# EAGLE design 40G_ACCELEROMETER_REV_2 (EAGLE 9.6.2)
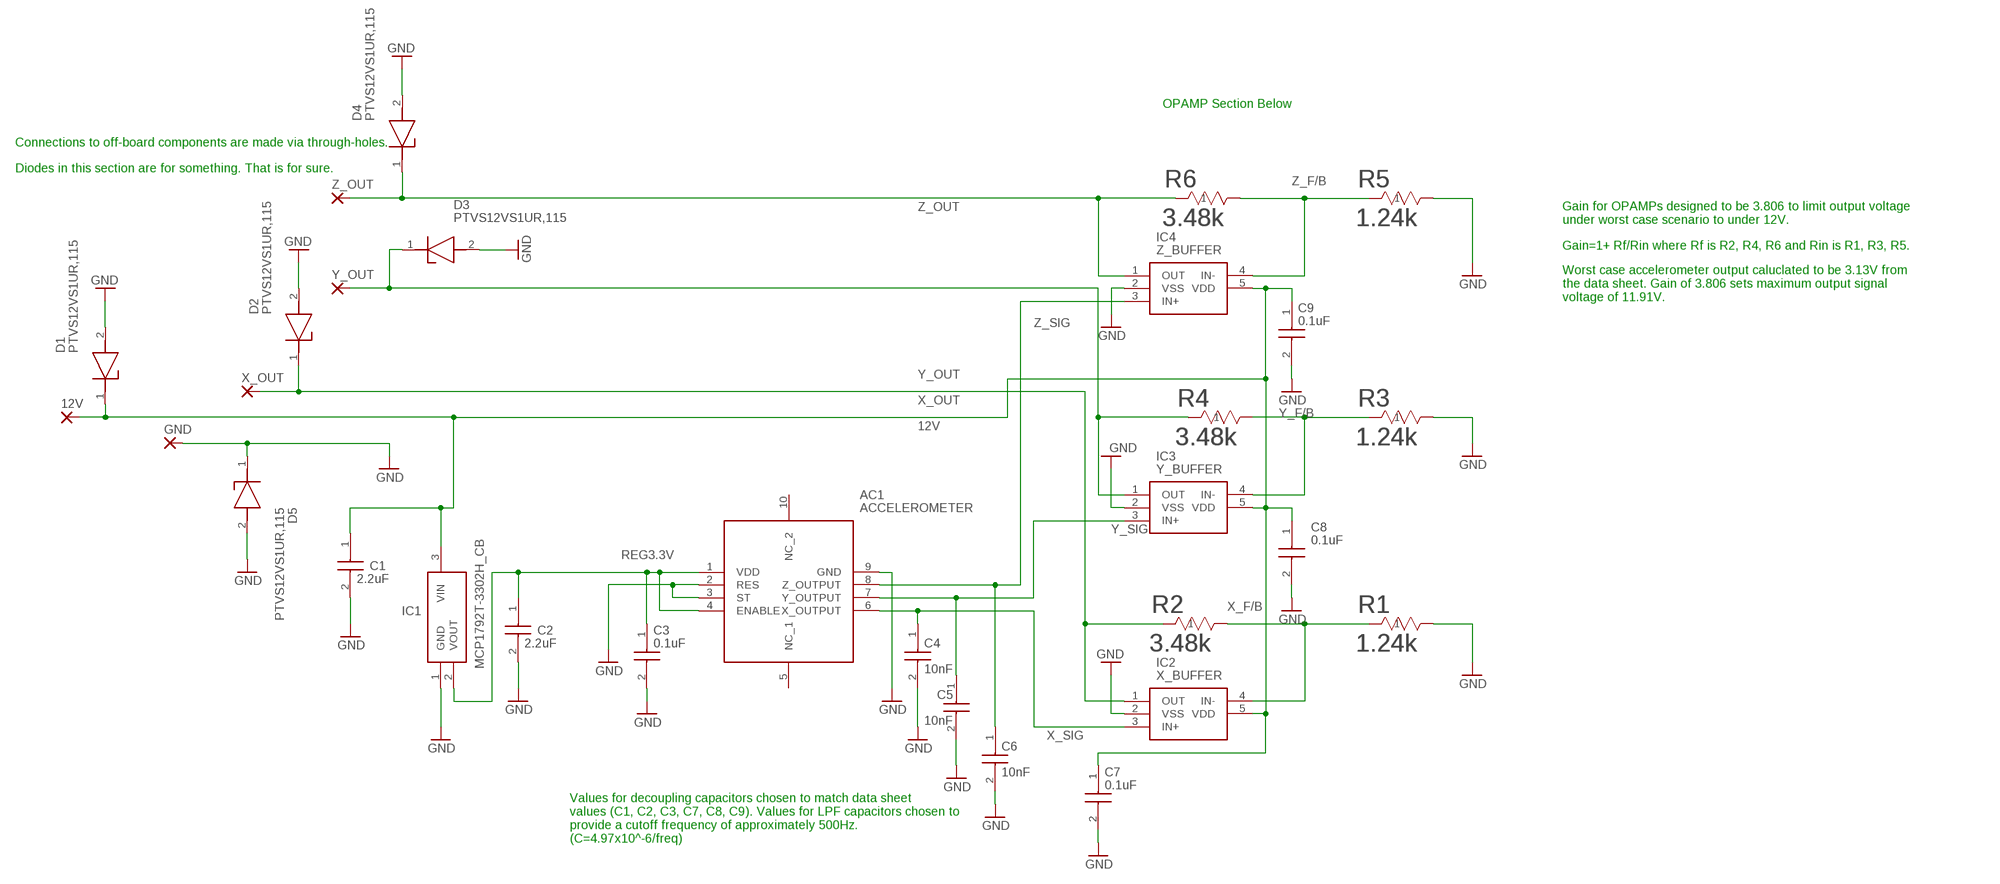
[diagram p0: schematic, sheet 1]

## Parts
12V  2,54/1,1  [2,54/1,1]
AC1  ACCELEROMETER  KX220-1072  [KX2201072]
C1  2.2uF  CGA3E1X7R0J225K080AC  [CAPC1608X90N]
C2  2.2uF  CGA3E1X7R0J225K080AC  [CAPC1608X90N]
C3  0.1uF  CGA3E2X7R1H104K080AE  [CAPC1608X90N]
C4  10nF  CGA3E1C0G2A103J080AE  [CAPC1608X90N]
C5  10nF  CGA3E1C0G2A103J080AE  [CAPC1608X90N]
C6  10nF  CGA3E1C0G2A103J080AE  [CAPC1608X90N]
C7  0.1uF  CGA3E2X7R1H104K080AE  [CAPC1608X90N]
C8  0.1uF  CGA3E2X7R1H104K080AE  [CAPC1608X90N]
C9  0.1uF  CGA3E2X7R1H104K080AE  [CAPC1608X90N]
D1  PTVS12VS1UR,115  [SOD123W]
D2  PTVS12VS1UR,115  [SOD123W]
D3  PTVS12VS1UR,115  [SOD123W]
D4  PTVS12VS1UR,115  [SOD123W]
D5  PTVS12VS1UR,115  [SOD123W]
GND  2,54/1,1  [2,54/1,1]
IC1  MCP1792T-3302H_CB  [SOT95P255X145-3N]
IC2  X_BUFFER  NCS21911SN2T1G  [SOT95P275X110-5N]
IC3  Y_BUFFER  NCS21911SN2T1G  [SOT95P275X110-5N]
IC4  Z_BUFFER  NCS21911SN2T1G  [SOT95P275X110-5N]
R1  1.24k  TNPW04021K24BEED  [RES_TNPW0402_VIS]
R2  3.48k  TNPW04023K48BEED  [RES_TNPW0402_VIS]
R3  1.24k  TNPW04021K24BEED  [RES_TNPW0402_VIS]
R4  3.48k  TNPW04023K48BEED  [RES_TNPW0402_VIS]
R5  1.24k  TNPW04021K24BEED  [RES_TNPW0402_VIS]
R6  3.48k  TNPW04023K48BEED  [RES_TNPW0402_VIS]
X_OUT  2,54/1,1  [2,54/1,1]
Y_OUT  2,54/1,1  [2,54/1,1]
Z_OUT  2,54/1,1  [2,54/1,1]

## Nets
12V: 12V.1(P) C1.1 C7.1 C8.1 C9.1 D1.1(K) IC1.3(VIN) IC2.5(VDD) IC3.5(VDD) IC4.5(VDD)
GND: AC1.2(RES) AC1.3(ST) AC1.9(GND) C1.2 C2.2 C3.2 C4.2 C5.2 C6.2 C7.2 C8.2 C9.2 D1.2(A) D2.2(A) D3.2(A) D4.2(A) D5.1(K) D5.2(A) GND.1(P) IC1.1(GND) IC2.2(VSS) IC3.2(VSS) IC4.2(VSS) R1.2 R3.2 R5.2
REG3.3V: AC1.1(VDD) AC1.4(ENABLE) C2.1 C3.1 IC1.2(VOUT)
X_F/B: IC2.4(IN-) R1.1 R2.2
X_OUT: D2.1(K) IC2.1(OUT) R2.1 X_OUT.1(P)
X_SIG: AC1.6(X_OUTPUT) C4.1 IC2.3(IN+)
Y_F/B: IC3.4(IN-) R3.1 R4.2
Y_OUT: D3.1(K) IC3.1(OUT) R4.1 Y_OUT.1(P)
Y_SIG: AC1.7(Y_OUTPUT) C5.1 IC3.3(IN+)
Z_F/B: IC4.4(IN-) R5.1 R6.2
Z_OUT: D4.1(K) IC4.1(OUT) R6.1 Z_OUT.1(P)
Z_SIG: AC1.8(Z_OUTPUT) C6.1 IC4.3(IN+)
Unconnected: AC1.5(NC_1) AC1.10(NC_2)

## Notes on the sheet
- OPAMP Section Below
- Connections to off-board components are made via through-holes.
- Diodes in this section are for something. That is for sure.
- Gain for OPAMPs designed to be 3.806 to limit output voltage
  under worst case scenario to under 12V.
- Gain=1+ Rf/Rin where Rf is R2, R4, R6 and Rin is R1, R3, R5.
- Worst case accelerometer output caluclated to be 3.13V from
  the data sheet. Gain of 3.806 sets maximum output signal
  voltage of 11.91V.
- Values for decoupling capacitors chosen to match data sheet
  values (C1, C2, C3, C7, C8, C9). Values for LPF capacitors chosen to
  provide a cutoff frequency of approximately 500Hz. 
  (C=4.97x10^-6/freq)

## Library data of the parts
12V GND X_OUT Y_OUT Z_OUT = wirepad:2,54/1,1: THROUGH-HOLE PAD
AC1 = SamacSys_Parts:KX220-1072: MEMS ACCELEROMETERS, 40G; MEMS Sensor Output:Analogue; Measurement Axis:X, Y, Z; Acceleration Range:+/- 40g; Supply Voltage Min:1.8V; Supply Voltage Max:3.6V; Sensor Case Style:LGA; No. of Pins:10Pins; Sensitivity Typ:30mV/g; RoHS Compliant: Yes Source: Datasheet <https://componentsearchengine.com/Datasheets/1/KX220-1072.pdf>; DESCRIPTION: MEMS ACCELEROMETERS, 40G; MEMS Sensor Output:Analogue; Measurement Axis:X, Y, Z; Acceleration Range:+/- 40g; Supply Voltage Min:1.8V; Supply Voltage Max:3.6V; Sensor Case Style:LGA; No. of Pins:10Pins; Sensitivity Typ:30mV/g; RoHS Compliant: Yes; HEIGHT: 1.01mm; MANUFACTURER_NAME: Kionix; MANUFACTURER_PART_NUMBER: KX220-1072; MOUSER_PART_NUMBER: 912-KX220-1072; MOUSER_PRICE-STOCK: https://www.mouser.co.uk/ProductDetail/Kionix/KX220-1072?qs=W0yvOO0ixfHJG%2FXzR0NLpg%3D%3D
C1 C2 = SamacSys_Parts:CGA3E1X7R0J225K080AC: Multilayer Ceramic Chip Capacitors, Capacitance=2.2uF, LxWxT:1.6x0.8x0.8mm Source: Datasheet <https://product.tdk.com/system/files/dam/doc/product/capacitor/ceramic/mlcc/catalog/mlcc_automotive_general_en.pdf>; DESCRIPTION: Multilayer Ceramic Chip Capacitors, Capacitance=2.2uF, LxWxT:1.6x0.8x0.8mm; HEIGHT: 0.9mm; MANUFACTURER_NAME: TDK; MANUFACTURER_PART_NUMBER: CGA3E1X7R0J225K080AC; MOUSER_PART_NUMBER: 810-CGA3E1X7R0J225K; MOUSER_PRICE-STOCK: https://www.mouser.co.uk/ProductDetail/TDK/CGA3E1X7R0J225K080AC?qs=NRhsANhppD%252BCEJjlpJUsyg%3D%3D
C3 C7-C9 = SamacSys_Parts:CGA3E2X7R1H104K080AE: Multilayer Ceramic Chip Capacitors, Capacitance=0.1uF, LxWxT:1.6x0.8x0.8mm Source: Datasheet <https://product.tdk.com/system/files/dam/doc/product/capacitor/ceramic/mlcc/catalog/mlcc_automotive_soft_en.pdf>; DESCRIPTION: Multilayer Ceramic Chip Capacitors, Capacitance=0.1uF, LxWxT:1.6x0.8x0.8mm; HEIGHT: 0.9mm; MANUFACTURER_NAME: TDK; MANUFACTURER_PART_NUMBER: CGA3E2X7R1H104K080AE; MOUSER_PART_NUMBER: 810-CGA3E2X7R1H104KE; MOUSER_PRICE-STOCK: https://www.mouser.co.uk/ProductDetail/TDK/CGA3E2X7R1H104K080AE?qs=n%2FVzw7c4a0kvajqFvEbDzQ%3D%3D
C4-C6 = SamacSys_Parts:CGA3E1C0G2A103J080AE: Multilayer Ceramic Capacitors MLCC - SMD/SMT 0603 100V 10nF 5% SOFT C0G AEC-Q200 Source: Datasheet <https://product.tdk.com/system/files/dam/doc/product/capacitor/ceramic/mlcc/catalog/mlcc_automotive_soft_en.pdf>; DESCRIPTION: Multilayer Ceramic Capacitors MLCC - SMD/SMT 0603 100V 10nF 5% SOFT C0G AEC-Q200; HEIGHT: 0.9mm; MANUFACTURER_NAME: TDK; MANUFACTURER_PART_NUMBER: CGA3E1C0G2A103J080AE; MOUSER_PART_NUMBER: 810-CGA3E1C0G2A103J0; MOUSER_PRICE-STOCK: https://www.mouser.co.uk/ProductDetail/TDK/CGA3E1C0G2A103J080AE?qs=r5DSvlrkXmK9f6QnOjYfCw%3D%3D
D1-D5 = SamacSys_Parts:PTVS12VS1UR,115: PTVSxS1UR series - 400 W Transient Voltage Suppressor Source: Datasheet <https://assets.nexperia.com/documents/data-sheet/PTVSXS1UR_SER.pdf>; DESCRIPTION: PTVSxS1UR series - 400 W Transient Voltage Suppressor; HEIGHT: mm; MANUFACTURER_NAME: Nexperia; MANUFACTURER_PART_NUMBER: PTVS12VS1UR,115; MOUSER_PART_NUMBER: 771-PTVS12VS1UR115; MOUSER_PRICE-STOCK: https://www.mouser.co.uk/ProductDetail/Nexperia/PTVS12VS1UR115?qs=LMSg3oBIm%2FiWSHvsyxWiLg%3D%3D
IC1 = SamacSys_Parts:MCP1792T-3302H_CB: LDO Voltage Regulators High input voltage regulator 3.3V 3Ld SOT-23A TR Source: Datasheet; DESCRIPTION: LDO Voltage Regulators High input voltage regulator 3.3V 3Ld SOT-23A TR; HEIGHT: 1.45mm; MANUFACTURER_NAME: Microchip; MANUFACTURER_PART_NUMBER: MCP1792T-3302H/CB; MOUSER_PART_NUMBER: 579-MCP1792T-3302HCB; MOUSER_PRICE-STOCK: https://www.mouser.co.uk/ProductDetail/Microchip-Technology/MCP1792T-3302H-CB?qs=mAH9sUMRCtsJR7ybQ6HmQA%3D%3D
IC2-IC4 = SamacSys_Parts:NCS21911SN2T1G: Operational Amplifiers - Op Amps 2 MHz Source: Datasheet <https://www.arrow.com/en/products/ncs21911sn2t1g/on-semiconductor>; DESCRIPTION: Operational Amplifiers - Op Amps 2 MHz; HEIGHT: 1.1mm; MANUFACTURER_NAME: ON Semiconductor; MANUFACTURER_PART_NUMBER: NCS21911SN2T1G; MOUSER_PART_NUMBER: 863-NCS21911SN2T1G; MOUSER_PRICE-STOCK: https://www.mouser.co.uk/ProductDetail/onsemi/NCS21911SN2T1G?qs=%252B6g0mu59x7Ix%2FTFBhvJ5Cw%3D%3D
R1 R3 R5 = SamacSys_Parts:TNPW04021K24BEED; COPYRIGHT: Copyright (C) 2022 Ultra Librarian. All rights reserved.; MANUFACTURER_PART_NUMBER: TNPW04021K24BEED; MFR_NAME: Vishay
R2 R4 R6 = SamacSys_Parts:TNPW04023K48BEED; COPYRIGHT: Copyright (C) 2022 Ultra Librarian. All rights reserved.; MANUFACTURER_PART_NUMBER: TNPW04023K48BEED; MFR_NAME: Vishay

## Board
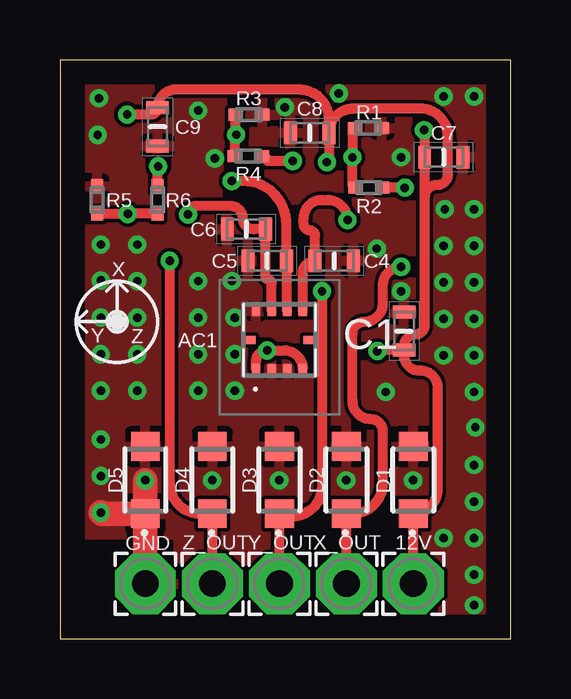
[diagram p1: board, top side]
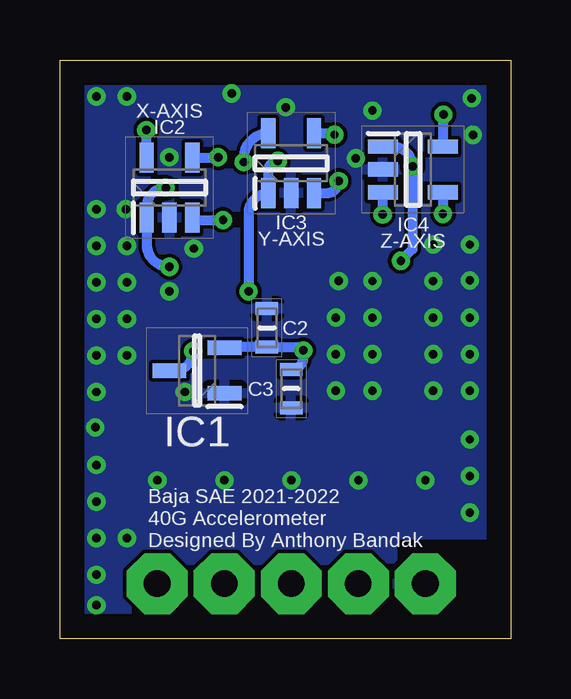
[diagram p2: board, bottom side, seen from below]

Size 18.8 x 24.13 mm. Coordinates in mm from the lower left corner, seen from the top.
Outline: 0,0 18.8,0 18.8,24.13 0,24.13 0,0
Copper layers (1*16): Top 0.035mm / dielectric 1.5mm / Bottom 0.035mm
Design rules "default *": minimum track width 6mil, minimum drill 0.35mm, track to track 6mil, track to pad 6mil, pad to pad 6mil, via to via 6mil, smd to smd 6mil, copper to edge 40mil, drill to drill 6mil, minimum pad ring 10mil, minimum via ring 8mil, stop-mask expansion 4mil, vias tented up to drill 20mil, thermal gap 10mil

### Footprints (pad centres in the part's own frame; a part is rotated, then mirrored left to right if it is on the bottom)
2,54/1,1 = drill 1.118 pad 2.54 octagon: 1 0,0
KX2201072 = smd 0.4 x 0.35: 1 -1.2,0.975; 2 -1.2,0.325; 3 -1.2,-0.325; 4 -1.2,-0.975; 6 1.2,-0.975; 7 1.2,-0.325; 8 1.2,0.325; 9 1.2,0.975 | smd 0.35 x 0.4: 5 0,-1.2; 10 0,1.2
CAPC1608X90N = smd 0.54 x 0.94: 1 -0.8,0; 2 0.8,0
SOD123W = smd 1.2 x 1.2: 1 -1.4,0; 2 1.4,0
SOT95P255X145-3N = smd 1.4 x 0.6: 1 -1.15,0.95; 2 -1.15,-0.95; 3 1.15,0
SOT95P275X110-5N = smd 1.25 x 0.6: 1 -1.25,0.95; 2 -1.25,0; 3 -1.25,-0.95; 4 1.25,-0.95; 5 1.25,0.95
RES_TNPW0402_VIS = smd 0.556 x 0.5: 1 -0.578,0; 2 0.578,0

### Placement (x,y rotation side)
12V  14.74,2.29 0 top
AC1  9.15,12.45 90 top
C1  14.35,12.83 90 top
C2  10.17,12.96 90 bottom
C3  9.15,10.42 270 bottom
C4  11.44,15.76 0 top
C5  8.64,15.76 180 top
C6  7.78,17.08 180 top
C7  16.01,20.07 0 top
C8  10.42,21.09 180 top
C9  4.07,21.34 270 top
D1  14.74,6.61 90 top
D2  11.94,6.61 90 top
D3  9.15,6.61 90 top
D4  6.36,6.61 90 top
D5  3.56,6.61 90 top
GND  3.56,2.29 0 top
IC1  13.08,11.18 180 bottom
IC2  14.23,18.8 90 bottom
IC3  9.15,19.82 90 bottom
IC4  4.07,19.57 0 bottom
R1  12.86,21.29 0 top
R2  12.88,18.8 180 top
R3  7.88,21.85 0 top
R4  7.86,20.13 180 top
R5  1.56,18.3 90 top
R6  4.07,18.3 270 top
X_OUT  11.94,2.29 0 top
Y_OUT  9.15,2.29 0 top
Z_OUT  6.36,2.29 0 top

### Tracks (layer width: path | path; a pad name or v marks a point on that pad's centre or on a via)
12V  (via drill 0.35)
  Top 0.406: C8.1 11.22,19.96 arc-90 v11.13,19.87 | 12V.1 D1.1 arc90 15.75,6.23 15.75,10.46 arc90 15.04,11.18 14.99,11.18 arc-90 14.35,11.81 C1.1 | v2.8,21.85 3.78,21.85 arc90 C9.1 arc-90 4.82,22.89 9.98,22.89 arc-90 11.22,21.65 C8.1 | 15.21,18.38 arc-90 15.75,18.92 arc90 16.18,19.36 16.18,20.95 arc90 15.03,22.11 12.24,22.11 arc90 C8.1 | 15.21,18.38 C7.1 15.21,21.19 arc90 v15.19,21.21 | C1.1 14.35,12.19 arc-90 14.86,12.7 arc90 15.21,13.05 15.21,18.38 | C1.1 13.27,12.03 arc90 v13.23,11.99
  Bottom 0.406: IC3.5 arc-90 11.13,20.04 v11.13,19.87 | IC4.5 arc-90 2.8,20.54 v2.8,21.85 | IC2.5 v15.18,21.2 arc90 v15.19,21.21 | IC1.3 14.05,11.18 arc-90 v13.23,11.99
GND  (via drill 0.35)
  Top 1.016: GND.1 D5.1 | D5.1 arc-90 D5.1 v3.56,6.6 | D5.1 1.75,5.21 arc-90 v1.7,5.26
  other vias: 6.46,20.02 13.21,16.26 9.38,22.16 14.23,20.07 17.27,1.4 7.17,14.92 14.23,14.49 5.77,22.02 1.63,22.53 1.57,21.01 1.7,16.43 3.23,16.43 3.23,14.91 5.77,14.91 5.77,13.39 5.77,11.86 5.77,10.34 3.23,10.34 3.23,11.86 1.7,11.86 1.7,10.34 1.7,8.31 1.7,6.78 7.29,13.39 7.29,11.86 7.29,10.34 17.27,22.61 17.27,2.67 17.27,4.19 17.27,5.71 17.27,17.91 17.27,16.38 17.27,14.86 17.27,13.34 17.27,11.81 17.27,10.29 17.32,8.81 17.27,7.24 16,22.61 16,4.19 16,11.81 16.05,17.91 16,16.38 16,14.86 16,13.34 13.59,10.29 14.73,6.6 11.94,6.6 9.14,6.6 6.35,6.6 3.23,13.39 11.63,22.73 1.7,14.94 1.7,13.39
  pour Bottom: 0,24.13 0,4.32 4.95,4.32 4.95,0 18.8,0 18.8,24.13
  pour Top: 4.95,0 4.95,4.32 0,4.32 0,24.13 18.8,24.13 18.8,0
REG3.3V  (via drill 0.35)
  Top 0.406: AC1.1 8.18,11.55 arc-90 v8.64,12.02 9.36,12.02 arc-90 AC1.4
  Bottom 0.406: C3.1 arc-90 8.64,11.73 v8.64,12.02 arc-90 8.78,12.16 C2.1 11.89,12.16 | 11.89,12.16 IC1.2 arc90 11.89,12.16
X_F/B  (via drill 0.35)
  Top 0.406: R1.1 arc90 12.2,21.21 v12.2,20.07 12.2,18.91 arc90 R2.2
  Bottom 0.406: IC2.4 12.22,20.05 arc-90 v12.2,20.07
X_OUT  (via drill 0.35)
  Top 0.406: v14.38,18.8 R2.1 | X_OUT.1 D2.1 12.2,5.21 arc90 13.47,6.48 13.47,8.64 arc90 12.96,9.15 arc-90 12.2,9.91 12.2,12.71 arc-90 12.71,13.22 arc90 13.47,13.98 13.47,14.74 arc-90 v14.23,15.5
  Bottom 0.406: v14.38,18.8 arc-90 15.18,18.01 IC2.1 15.18,16.45 arc-90 v14.23,15.5
X_SIG  (via drill 0.35)
  Top 0.406: AC1.6 10.12,15.24 arc-90 C4.1 10.64,16.81 arc90 10.42,17.03 arc-90 10.17,17.28 10.17,17.53 arc-90 10.93,18.3 11.16,18.3 arc-90 v11.99,17.46
  Bottom 0.406: IC2.3 arc-90 13.18,17.46 v11.99,17.46
Y_F/B  (via drill 0.35)
  Top 0.406: R3.1 7.3,21.06 v7.35,21.01 7.28,20.94 R4.2
  Bottom 0.406: IC3.4 7.4,21.07 arc90 v7.35,21.01
Y_OUT  (via drill 0.35)
  Top 0.406: Y_OUT.1 9.15,5.09 | 9.15,5.09 D3.1 | R4.1 arc-90 8.64,19.92 v9.71,19.92 | v10.93,14.49 10.93,6.36 arc-90 9.66,5.09 9.15,5.09
  Bottom 0.406: v9.71,19.92 arc-90 10.1,19.53 IC3.1 arc-90 10.93,17.74 v10.93,14.49
Y_SIG  (via drill 0.35)
  Top 0.406: AC1.7 9.47,15.72 arc90 C5.1 9.44,17.31 arc90 7.66,19.08 v7.17,19.08
  Bottom 0.406: IC3.3 7.68,18.57 arc-90 v7.17,19.08
Z_F/B  (via drill 0.35)
  Top 0.406: R5.1 2.82,17.72 arc-90 v2.83,17.71 arc-90 v2.83,17.72 R6.2
  Bottom 0.406: IC4.4 arc-90 IC4.4 v2.83,17.71
Z_OUT  (via drill 0.35)
  Top 0.406: Z_OUT.1 D4.1 5.85,5.21 arc-90 4.58,6.48 v4.58,15.76 | R6.1 4.07,19.67 arc-90 v4.1,19.69
  Bottom 0.406: IC4.1 4.92,20.52 arc90 v4.1,19.69 4.1,16.24 v4.58,15.76
Z_SIG  (via drill 0.35)
  Top 0.406: AC1.8 8.82,14.81 arc90 8.64,14.99 arc-90 8.58,15.06 C6.1 8.08,17.08 arc-90 7.63,17.53 arc90 7.12,18.04 5.7,18.04 arc90 v5.34,17.69
  Bottom 0.406: IC4.3 arc-90 5.34,18.6 v5.34,17.69

### Text on the board
tPlace: X | Y | Z
bPlace: X-AXIS | Z-AXIS | Y-AXIS | Baja SAE 2021-2022 / 40G Accelerometer / Designed By Anthony Bandak